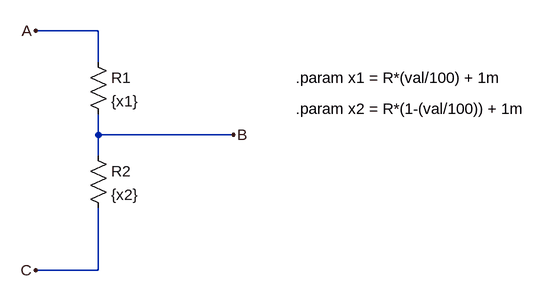
[diagram p0: schematic pot.asc]
pot.asc, the LTspice schematic file:
Version 4
SHEET 1 880 680
WIRE 16 -32 -80 -32
WIRE 16 16 16 -32
WIRE 16 128 16 96
WIRE 224 128 16 128
WIRE 16 160 16 128
WIRE 16 336 16 240
WIRE 16 336 -80 336
FLAG -80 -32 A
FLAG -80 336 C
FLAG 224 128 B
SYMBOL res 0 0 R0
SYMATTR InstName R1
SYMATTR Value {x1}
SYMBOL res 0 144 R0
SYMATTR InstName R2
SYMATTR Value {x2}
TEXT 320 40 Left 2 !.param x1 = R*(val/100) + 1m
TEXT 320 88 Left 2 !.param x2 = R*(1-(val/100)) + 1m

The netlist it stands for:
* pot.asc
R1 A B {x1}
R2 B C {x2}
.param x1 = R*(val/100) + 1m
.param x2 = R*(1-(val/100)) + 1m
.backanno
.end